# Altium schematic sheet FPGA_JTAG.SchDoc
size A4
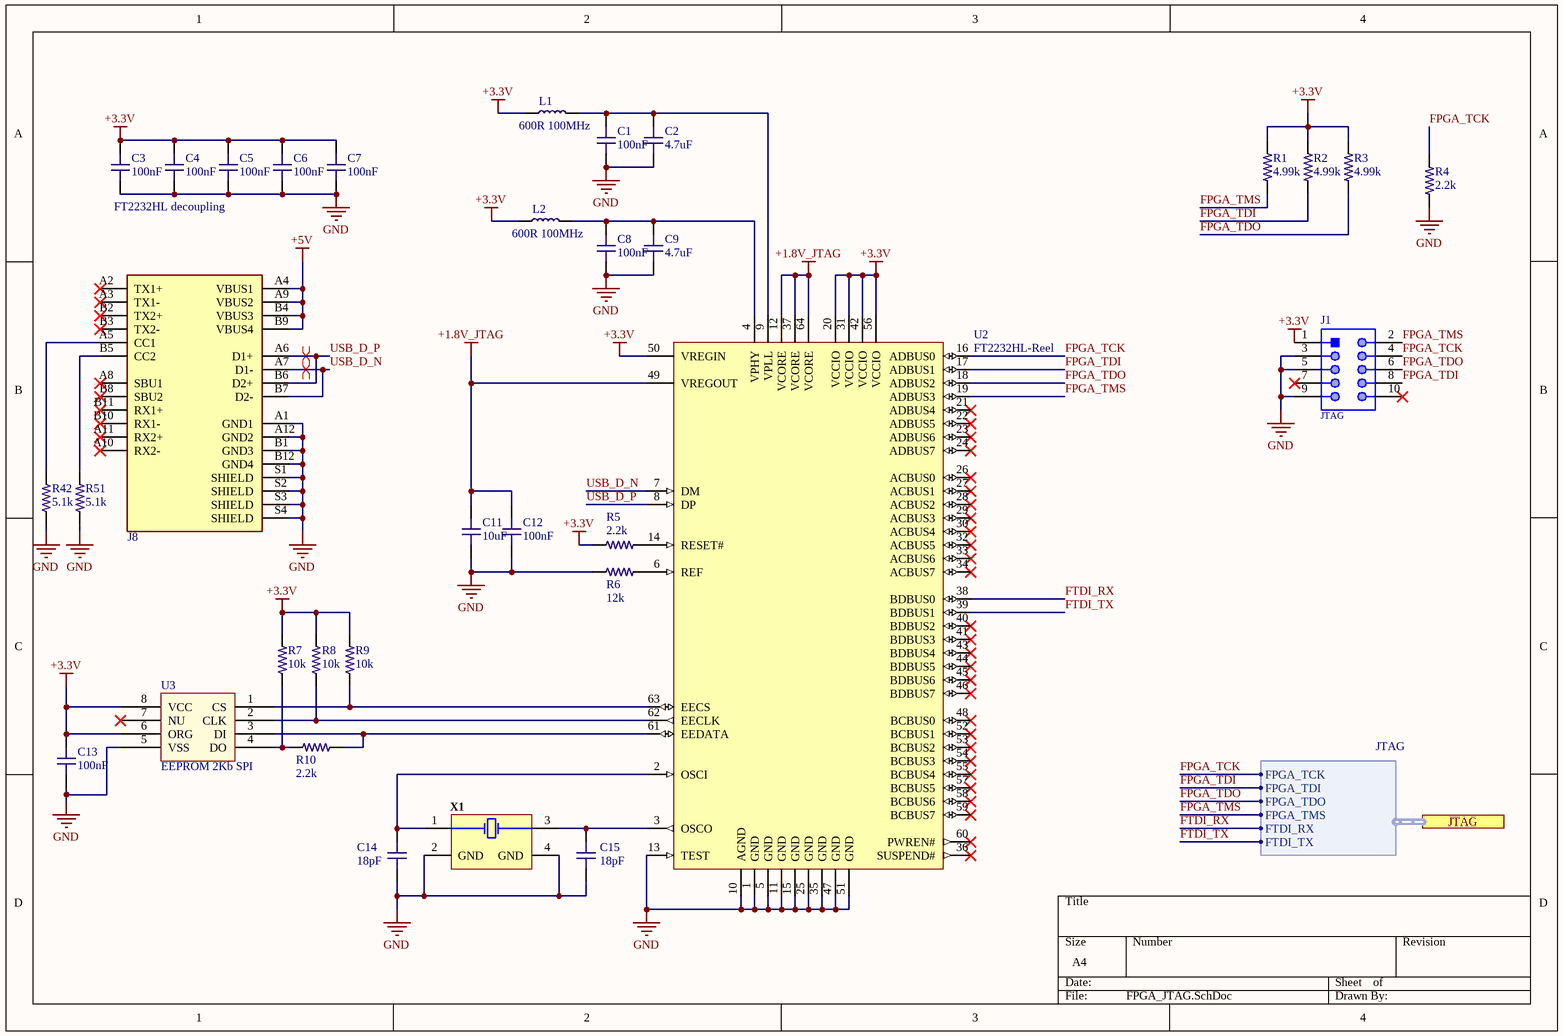
[diagram p0: FPGA_JTAG.SchDoc]

## Parts
C1  value 100nF  [C0603-HIGH-DENSITY]  (hidden comment: C0603 100nF 25V X7R)
C2  value 4.7uF  [C0603-HIGH-DENSITY]  (hidden comment: C0603 4.7uF 6.3V X5R)
C3  value 100nF  [C0603-HIGH-DENSITY]  (hidden comment: C0603 100nF 25V X7R)
C4  value 100nF  [C0603-HIGH-DENSITY]  (hidden comment: C0603 100nF 25V X7R)
C5  value 100nF  [C0603-HIGH-DENSITY]  (hidden comment: C0603 100nF 25V X7R)
C6  value 100nF  [C0603-HIGH-DENSITY]  (hidden comment: C0603 100nF 25V X7R)
C7  value 100nF  [C0603-HIGH-DENSITY]  (hidden comment: C0603 100nF 25V X7R)
C8  value 100nF  [C0603-HIGH-DENSITY]  (hidden comment: C0603 100nF 25V X7R)
C9  value 4.7uF  [C0603-HIGH-DENSITY]  (hidden comment: C0603 4.7uF 6.3V X5R)
C11  value 10uF  [C0603-HIGH-DENSITY]  (hidden comment: C0603 10uF 10V X5R)
C12  value 100nF  [C0603-HIGH-DENSITY]  (hidden comment: C0603 100nF 25V X7R)
C13  value 100nF  [C0603-HIGH-DENSITY]  (hidden comment: C0603 100nF 25V X7R)
C14  value 18pF  [C0603-HIGH-DENSITY]  (hidden comment: C0603 18pF 50V C0G_1)
C15  value 18pF  [C0603-HIGH-DENSITY]  (hidden comment: C0603 18pF 50V C0G_1)
J1  JTAG  [61201021621]
J8  USB C  [Molex USB-C]  (value not drawn)
L1  value 600R 100MHz  [L0603]  (hidden comment: Ferrite Bead)
L2  value 600R 100MHz  [L0603]  (hidden comment: Ferrite Bead)
R1  value 4.99k  [R0603-HIGH-DENSITY]  (hidden comment: R0603 4.99K 0.1%)
R2  value 4.99k  [R0603-HIGH-DENSITY]  (hidden comment: R0603 4.99K 0.1%)
R3  value 4.99k  [R0603-HIGH-DENSITY]  (hidden comment: R0603 4.99K 0.1%)
R4  value 2.2k  [R0603-HIGH-DENSITY]  (hidden comment: R0603 2.2K 1%)
R5  value 2.2k  [R0603-HIGH-DENSITY]  (hidden comment: R0603 2.2K 1%)
R6  value 12k  [R0603-HIGH-DENSITY]  (hidden comment: R0603 12k 1%)
R7  value 10k  [R0603-IPC]  (hidden comment: R0603 10K 1%)
R8  value 10k  [R0603-IPC]  (hidden comment: R0603 10K 1%)
R9  value 10k  [R0603-IPC]  (hidden comment: R0603 10K 1%)
R10  value 2.2k  [R0603-IPC]  (hidden comment: R0603 2.2K 1%)
R42  value 5.1k  [R0603-IPC-5.1K]  (hidden comment: R0603 5.1K 1%)
R51  value 5.1k  [R0603-IPC-5.1K]  (hidden comment: R0603 5.1K 1%)
U2  FT2232HL-Reel  [LQFP-64_M]
U3  EEPROM 2Kb SPI  [SOIC127P600X175-8N]
X1  ABM8G-12.000MHZ-18-D2Y-T  [ABRACON_ABM8G_V]  (value not drawn)

## Ports
JTAG (harness JTAG)

## Harnesses
JTAG: FPGA_TCK, FPGA_TDI, FPGA_TDO, FPGA_TMS, FTDI_RX, FTDI_TX

## Nets
+1.8V_JTAG: C11.2 C12.2 U2.12(VCORE) U2.37(VCORE) U2.49(VREGOUT) U2.64(VCORE)
+3.3V: C3.2 C4.2 C5.2 C6.2 C7.2 C13.2 J1.1 L1.1 L2.1 R1.2 R2.2 R3.2 R5.2 R7.2 R8.2 R9.2 U2.20(VCCIO) U2.31(VCCIO) U2.42(VCCIO) U2.50(VREGIN) U2.56(VCCIO) U3.6(ORG) U3.8(VCC)
+5V: J8.A4(VBUS1) J8.A9(VBUS2) J8.B4(VBUS3) J8.B9(VBUS4)
GND: C1.1 C2.1 C3.1 C4.1 C5.1 C6.1 C7.1 C8.1 C9.1 C11.1 C12.1 C13.1 C14.1 C15.1 J1.3 J1.5 J1.9 J8.A1(GND1) J8.A12(GND2) J8.B1(GND3) J8.B12(GND4) J8.S1(SHIELD) J8.S2(SHIELD) J8.S3(SHIELD) J8.S4(SHIELD) R4.1 R6.1 R42.1 R51.1 U2.1(GND) U2.5(GND) U2.10(AGND) U2.11(GND) U2.13(TEST) U2.15(GND) U2.25(GND) U2.35(GND) U2.47(GND) U2.51(GND) U3.5(VSS) X1.2(GND) X1.4(GND)
FPGA_TCK: J1.4 R4.2 U2.16(ADBUS0) ; port JTAG.FPGA_TCK
FPGA_TDI: J1.8 R2.1 U2.17(ADBUS1) ; port JTAG.FPGA_TDI
FPGA_TDO: J1.6 R3.1 U2.18(ADBUS2) ; port JTAG.FPGA_TDO
FPGA_TMS: J1.2 R1.1 U2.19(ADBUS3) ; port JTAG.FPGA_TMS
FTDI_RX: U2.38(BDBUS0) ; port JTAG.FTDI_RX
FTDI_TX: U2.39(BDBUS1) ; port JTAG.FTDI_TX
USB_D_N: J8.A7(D1-) J8.B7(D2-) U2.7(DM)
USB_D_P: J8.A6(D1+) J8.B6(D2+) U2.8(DP)
NetC1_2: C1.2 C2.2 L1.2 U2.9(VPLL)
NetC8_2: C8.2 C9.2 L2.2 U2.4(VPHY)
NetC14_2: C14.2 U2.2(OSCI) X1.1(X1)
NetC15_2: C15.2 U2.3(OSCO) X1.3(X2)
NetJ8_A5: J8.A5(CC1) R42.2
NetJ8_B5: J8.B5(CC2) R51.2
NetR5_1: R5.1 U2.14(RESET#)
NetR6_2: R6.2 U2.6(REF)
NetR7_1: R7.1 R10.2 U3.4(DO)
NetR8_1: R8.1 U2.62(EECLK) U3.2(CLK)
NetR9_1: R9.1 U2.63(EECS) U3.1(CS)
NetR10_1: R10.1 U2.61(EEDATA) U3.3(DI)

Not connected (* = marked no-connect by the designer): J1 7* 10*; J8 A2(TX1+)* A3(TX1-)* A8(SBU1)* A10(RX2-)* A11(RX2+)* B2(TX2+)* B3(TX2-)* B8(SBU2)* B10(RX1-)* B11(RX1+)*; U2 21(ADBUS4)* 22(ADBUS5)* 23(ADBUS6)* 24(ADBUS7)* 26(ACBUS0)* 27(ACBUS1)* 28(ACBUS2)* 29(ACBUS3)* 30(ACBUS4)* 32(ACBUS5)* 33(ACBUS6)* 34(ACBUS7)* 36(SUSPEND#)* 40(BDBUS2)* 41(BDBUS3)* 43(BDBUS4)* 44(BDBUS5)* 45(BDBUS6)* 46(BDBUS7)* 48(BCBUS0)* 52(BCBUS1)* 53(BCBUS2)* 54(BCBUS3)* 55(BCBUS4)* 57(BCBUS5)* 58(BCBUS6)* 59(BCBUS7)* 60(PWREN#)*; U3 7(NU)*

## Layout directives
differential pair; differential pair class USB: USB_D_N, USB_D_P

## Notes on the sheet
- FT2232HL decoupling

## Library data of the parts
C1 C3-C8 C12 C13 = C0603 100nF 25V X7R: Chip Capacitor, 0603, 100nF, 25V, X7R; EIA Code: X7R; Max. Voltage: 25V; Supplier 1: Digi-Key; Supplier Part Number 1: 490-1524-1-ND
C2 C9 = C0402 4.7uF 6.3V X5R: Chip Capacitor, 0603, 4.7uF, 10V, X5R; EIA Code: X5R; Max. Voltage: 10V; Supplier 1: Digi-Key; Supplier Part Number 1: 1276-1907-1-ND
C11 = C0603 10uF 10V X5R: Chip Capacitor, 0603, 10uF, 10V, X5R; EIA Code: X7R; Max. Voltage: 10V; Supplier 1: Digi-Key; Supplier Part Number 1: 490-10474-1-ND
C14 C15 = C0402 18pF 50V C0G_1: Chip Capacitor, 0603, 18pF, 25V, C0G; Max. Voltage: 25V; Supplier 1: Digi-Key; Supplier Part Number 1: 399-9019-1-ND; EIA Code: C0G
J1 = CMP-1502-00007-1: Male Box Header WR-BHD, THT, Vertical, pitch 2.54 mm, 10 pins; Manufacturer: Wurth Elektronik; Contact Resistance: 20mOhm; Withstanding Voltage: 500VAC; Pin Number: 10; Working Voltage: 250VAC; Pitch: 2.54mm; Mounting Technology: THT; Operating Temperature: -40to125degC; Published Date: August2018; Gender: Male; Packaging: Tray; Manufacturer URL: http://www.we-online.de; Datasheet URL: https://katalog.we-online.de/em/datasheet/6120xx21621.pdf; Orientation: Vertical; Package Reference: 61201021621; Part Number: 61201021621; Publisher: WurthElektronik
J8 = USB C: USB-C USB 3.1 Gen 2, Superspeed+_ Receptacle Connector 24 Position Surface Mount, Right Angle; Through Hole; MF: Molex; MP: 1054500101; Package: None; Digi-Key_Part_Number: WM12856CT-ND; SnapEDA_Link: https://www.snapeda.com/parts/1054500101/Molex/view-part/448528/?ref=snap; Digi-Key_Purchase_URL: https://www.digikey.tw/product-detail/en/molex/1054500101/WM12856CT-ND/5843891?utm_source=snapeda&utm_medium=aggregator&utm_campaign=symbol; Value: *; Supplier 1: Digi-Key; Supplier 2: Mouser; Supplier 3: LCSC; Supplier Part Number 1: WM12856CT-ND; Supplier Part Number 2: 538-105450-0101; Supplier Part Number 3: C134092
L1 L2 = FB 0603 600R @ 100MHz: 600 Ohms @ 100MHz 1 Ferrite Bead 0603 (1608 Metric) 500mA 380mOhm; Supplier 1: Digi-Key; Supplier Part Number 1: 490-1014-1-ND
R1-R3 = R0603 4.99K 0.1%: RES SMD 4.99KOHM 0.1% 1/10W 0603; Temperature Coefficient: ±25ppm/°C; Tolerance: ±0.1%; Features: Automotive AEC-Q200; Operating Temperature: -55°C ~ 155°C; Supplier 1: Digi-Key; Supplier Part Number 1: P4.99KDBCT-ND
R4 R5 R10 = R0603 2.2K 1%: RES SMD 2.2K OHM 1% 1/10W 0603; Temperature Coefficient: ±100ppm/°C; Features: Automotive AEC-Q200; Operating Temperature: -55°C ~ 155°C; Supplier 1: Digi-Key; Supplier Part Number 1: RMCF0603FT2K20CT-ND
R6 = R0603 12k 1%: RES 12K OHM 1% 1/10W 0603; Supplier 1: Digi-Key; Supplier Part Number 1: 541-12.0KHCT-ND
R7-R9 = R0603 10K 1%: RES SMD 10K OHM 1% 1/10W 0603; Supplier 1: Digi-Key; Supplier Part Number 1: RMCF0603FT10K0CT-ND
R42 R51 = R0603 5.1K 1%: RES SMD 5.1K OHM 1% 1/10W 0603; Temperature Coefficient: ±100ppm/°C; Features: Automotive AEC-Q200; Operating Temperature: -55°C ~ 155°C; Supplier 1: Digi-Key; Supplier Part Number 1: RMCF0603FT5K10CT-ND
U2 = CMP-0078-00023-3: Dual High Speed USB To Multipurpose UART/FIFO IC, 64-pin LQFP, Tape and Reel; Manufacturer: FTDI; DatasheetVersion: ver 2.21, Jun-2012; ComponentLink1URL: http://www.ftdichip.com/; PartNumber: FT2232HL-Reel; ComponentLink2Description: Datasheet; RevisionNote: DatasheetVersion updated to 2.21 Jun-2012; PackageVersion: Jun-12; ComponentLink1Description: Manufacturer URL; ComponentLink2URL: http://www.ftdichip.com/Support/Documents/DataSheets/ICs/DS_FT2232H.pdf; PackageReference: LQFP-64; PackageDescription: 64-Pin Thin Quad Flat Pack, 10 x 10 x 1.4 mm Body, 0.5 mm Pitch
U3 = 93LC56C-I/SN: EEPROM Memory IC 2Kb (256 x 8, 128 x 16) SPI 3MHz 8-SOIC; Supplier 1: Digi-Key; Supplier Part Number 1: 93LC56C-I/SN-ND
X1 = CMP-2000-05039-1: Ultra Miniature Ceramic Glass Sealed SMD Cryastal, 12 MHz, 18 pF, +/- 20 ppm, -40 to 85 degC, 4-Pin SMD, RoHS, Tape and Reel; Brand: ABRACON; ESR: 120Ohms; Case Length: 3.2mm; Tolerance: 20PPM; Frequency: 12MHz; Frequency Stability: 30PPM; Case Height: 1mm; Case Width: 2.5mm; Load Capacitance: 18pF; Termination Style: SMD/SMT; Mounting Style: SMD/SMT; Factory Pack Quantity: 1000; Series: ABM8G; Datasheet Version: Apr-17; Manufacturer: ABRACON; Packaging: Reel; Manufacturer URL: http://www.abracon.com/; RoHS: Details; Package / Case: 3.2mmx2.5mm; Type: UltraMiniatureGlassSealedCrystal; Datasheet URL: https://datasheet.ciiva.com/15116/getdatasheetpartid-719790-15116701.pdf; Operating Temperature Range: -40Cto+85C; Product Category: Crystals; Dimensions: 2.5mmWx3.2mmLx1mmH